# EAGLE design alu (EAGLE 6.5.0)
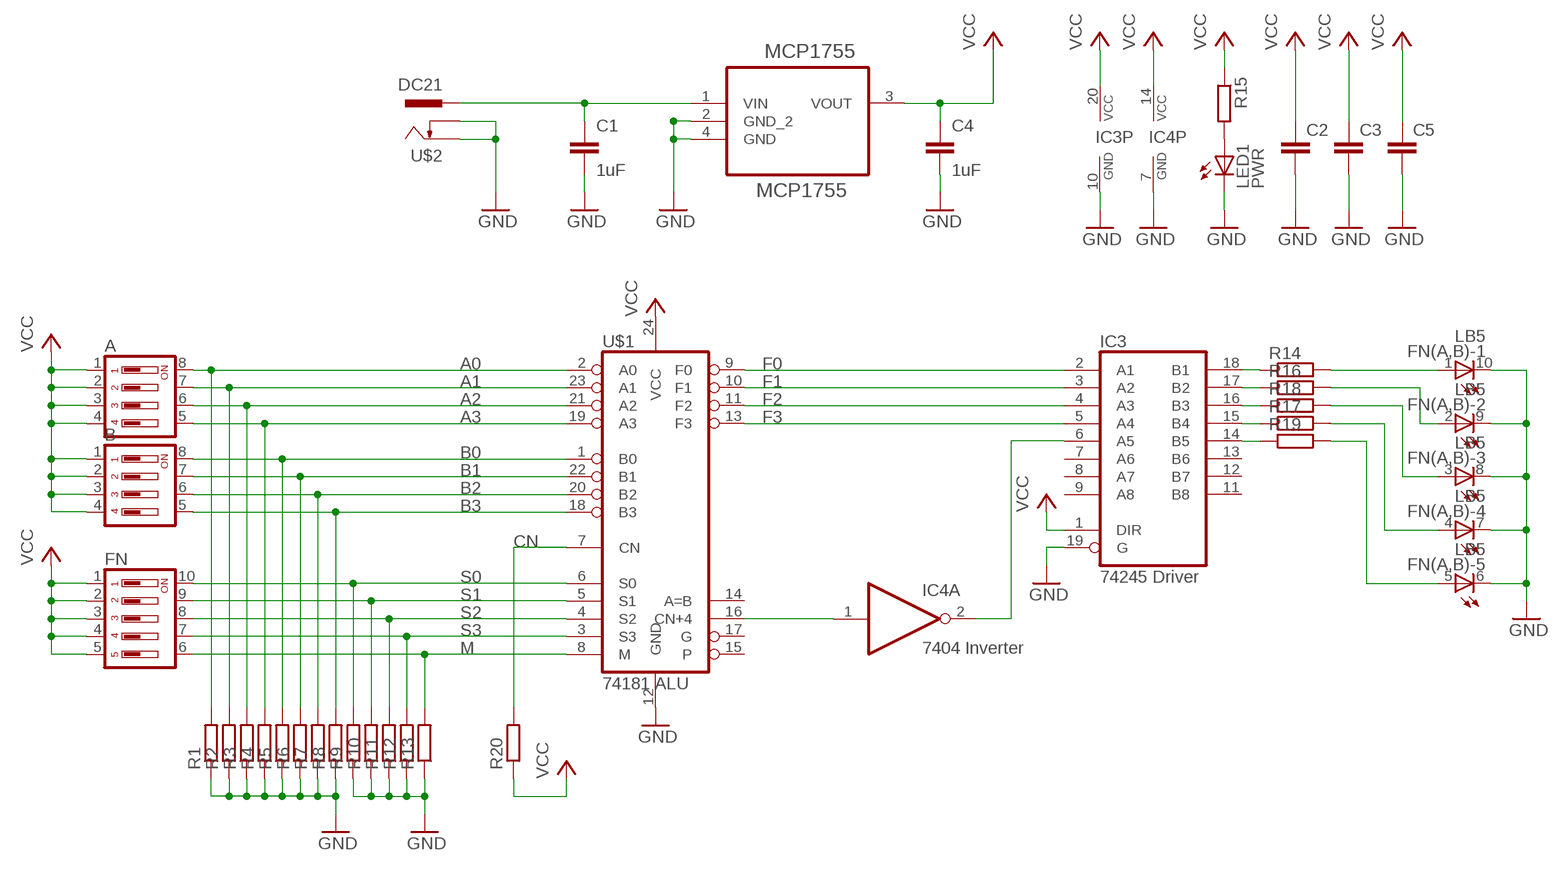
[diagram p0: schematic, sheet 1]

## Parts
A  DS04  [DS-04]
B  DS04  [DS-04]
C1  1uF  C-EUC0805  [C0805]
C2  C-EUC0805  [C0805]
C3  C-EUC0805  [C0805]
C4  1uF  C-EUC0805  [C0805]
C5  C-EUC0805  [C0805]
FN  DS05  [DS-05]
FN(A,B)  LB5  [LB5]
IC3  74245 Driver  74HC245N  [DIL20]
IC4  7404 Inverter  74HC04N  [DIL14]
LED1  PWR  LED3MM  [LED3MM]
MCP1755  MCP1755  MCP1755ST-5002E/DB  [SOT230P700X180-4N]
R1  R-EU_R0805  [R0805]
R2  R-EU_R0805  [R0805]
R3  R-EU_R0805  [R0805]
R4  R-EU_R0805  [R0805]
R5  R-EU_R0805  [R0805]
R6  R-EU_R0805  [R0805]
R7  R-EU_R0805  [R0805]
R8  R-EU_R0805  [R0805]
R9  R-EU_R0805  [R0805]
R10  R-EU_R0805  [R0805]
R11  R-EU_R0805  [R0805]
R12  R-EU_R0805  [R0805]
R13  R-EU_R0805  [R0805]
R14  R-EU_R0805  [R0805]
R15  470  R-EU_R0805  [R0805]
R16  R-EU_R0805  [R0805]
R17  R-EU_R0805  [R0805]
R18  R-EU_R0805  [R0805]
R19  R-EU_R0805  [R0805]
R20  R-EU_R0805  [R0805]
U$1  74181 ALU  MM74HC181N  [DIL24]
U$2  DC21  [DCSKT]

## Nets
!CN+4: IC3.6(A5) IC4.2(A:O)
+VRAW [VCC]: C1.1 MCP1755.1(VIN) U$2.1
A0: A.8 R1.2 U$1.2(A0)
A1: A.7 R2.2 U$1.23(A1)
A2: A.6 R3.2 U$1.21(A2)
A3: A.5 R4.2 U$1.19(A3)
B0: B.8 R5.2 U$1.1(B0)
B1: B.7 R6.2 U$1.22(B1)
B2: B.6 R7.2 U$1.20(B2)
B3: B.5 R8.2 U$1.18(B3)
CN: R20.2 U$1.7(CN)
CN+4: IC4.1(A:I) U$1.16(CN+4)
F0: IC3.2(A1) U$1.9(F0)
F1: U$1.10(F1)
F2: IC3.4(A3) U$1.11(F2)
F3: IC3.5(A4) U$1.13(F3)
GND [GND]: C1.2 C2.2 C3.2 C4.2 C5.2 FN(A,B).6(-5:C) FN(A,B).7(-4:C) FN(A,B).8(-3:C) FN(A,B).9(-2:C) FN(A,B).10(-1:C) IC3.10(GND) IC3.19(G) IC4.7(P:GND) LED1.K(C) MCP1755.2(GND_2) MCP1755.4(GND) R1.1 R2.1 R3.1 R4.1 R5.1 R6.1 R7.1 R8.1 R9.1 R10.1 R11.1 R12.1 R13.1 U$1.12(GND) U$2.2 U$2.3
M: FN.6 R13.2 U$1.8(M)
N$15: IC3.18(B1) R14.1
N$17: LED1.A R15.2
N$20: IC3.17(B2) R16.1
N$21: IC3.16(B3) R18.1
N$22: IC3.15(B4) R17.1
N$23: IC3.14(B5) R19.1
N$24: FN(A,B).1(-1:A) R14.2
N$25: FN(A,B).2(-2:A) R16.2
N$26: FN(A,B).3(-3:A) R18.2
N$28: FN(A,B).4(-4:A) R17.2
N$29: FN(A,B).5(-5:A) R19.2
S0: FN.10 R9.2 U$1.6(S0)
S1: FN.9 R10.2 U$1.5(S1)
S2: FN.8 R11.2 U$1.4(S2)
S3: FN.7 R12.2 U$1.3(S3)
VCC [VCC]: A.1 A.2 A.3 A.4 B.1 B.2 B.3 B.4 C2.1 C3.1 C4.1 C5.1 FN.1 FN.2 FN.3 FN.4 FN.5 IC3.1(DIR) IC3.20(VCC) IC4.14(P:VCC) MCP1755.3(VOUT) R15.1 R20.1 U$1.24(VCC)
Unconnected: IC3.3(A2) IC3.7(A6) IC3.8(A7) IC3.9(A8) IC3.11(B8) IC3.12(B7) IC3.13(B6) IC4.3(B:I) IC4.4(B:O) IC4.5(C:I) IC4.6(C:O) IC4.8(D:O) IC4.9(D:I) IC4.10(E:O) IC4.11(E:I) IC4.12(F:O) IC4.13(F:I) U$1.14(A=B) U$1.15(P) U$1.17(G)

## Library data of the parts
A B = switch-dil:DS04: DIL/CODE SWITCH; OC_FARNELL: 9471570; OC_NEWARK: unknown
C1-C5 = resistor:C-EU: CAPACITOR, European symbol
FN = switch-dil:DS05: DIL/CODE SWITCH; OC_FARNELL: 1255225; OC_NEWARK: unknown
FN(A,B) = thierry_eagle:LB5: LED BLOCK 5-LED bar graph, DIL, Siemens
IC3 = 74xx-eu:74*245: Octal BUS TRANSCEIVER, 3-state
IC4 = 74xx-eu:74*04: Hex INVERTER
LED1 = led:LED: LED OSRAM: - CHIPLED LG R971, LG N971, LY N971, LG Q971, LY Q971, LO R971, LY R971 LH N974, LH R974 LS Q976, LO Q976, LY Q976 LO Q996 - Hyper CHIPLED LW Q18S LB Q993, LB Q99A, LB R99A - SideLED LS A670, LO A670, LY A670, LG A670, LP A670 LB A673, LV A673, LT A673, LW A673 LH A674 LY A675 LS A676, LA A676, LO A676, LY A676, LW A676 LS A679, LY A679, LG A679 - Hyper Micro SIDELED® LS Y876, LA Y876, LO Y876, LY Y876 LT Y87S - SmartLED LW L88C, LW L88S LB L89C, LB L89S, LG L890 LS L89K, LO L89K, LY L89K LS L896, LA L896, LO L896, LY L896 - TOPLED LS T670, LO T670, LY T670, LG T670, LP T670 LSG T670, LSP T670, LSY T670, LOP T670, LYG T670 LG T671, LOG T671, LSG T671 LB T673, LV T673, LT T673, LW T673 LH T674 LS T676, LA T676, LO T676, LY T676, LB T676, LH T676, LSB T676, LW T676 LB T67C, LV T67C, LT T67C, LS T67K, LO T67K, LY T67K, LW E67C LS E67B, LA E67B, LO E67B, LY E67B, LB E67C, LV E67C, LT E67C LW T67C LS T679, LY T679, LG T679 LS T770, LO T770, LY T770, LG T770, LP T770 LB T773, LV T773, LT T773, LW T773 LH T774 LS E675, LA E675, LY E675, LS T675 LS T776, LA T776, LO T776, LY T776, LB T776 LHGB T686 LT T68C, LB T68C - Hyper Mini TOPLED® LB M676 - Mini TOPLED Santana® LG M470 LS M47K, LO M47K, LY M47K Source: http://www.osram.convergy.de LUXEON: - LUMILED® LXK2-PW12-R00, LXK2-PW12-S00, LXK2-PW14-U00, LXK2-PW14-V00 LXK2-PM12-R00, LXK2-PM12-S00, LXK2-PM14-U00 LXK2-PE12-Q00, LXK2-PE12-R00, LXK2-PE12-S00, LXK2-PE14-T00, LXK2-PE14-U00 LXK2-PB12-K00, LXK2-PB12-L00, LXK2-PB12-M00, LXK2-PB14-N00, LXK2-PB14-P00, LXK2-PB14-Q00 LXK2-PR12-L00, LXK2-PR12-M00, LXK2-PR14-Q00, LXK2-PR14-R00 LXK2-PD12-Q00, LXK2-PD12-R00, LXK2-PD12-S00 LXK2-PH12-R00, LXK2-PH12-S00 LXK2-PL12-P00, LXK2-PL12-Q00, LXK2-PL12-R00 Source: www.luxeon.com KINGBRIGHT: KA-3528ASYC Source: www.kingbright.com
MCP1755 = thierry_eagle:MCP1755ST-5002E/DB: LDO, 0.3VDO, 0.3A, 5V, 2%, 3SOT223; MPN: MCP1755ST-5002E/DB; OC_FARNELL: 2306611; OC_NEWARK: 88W3161; PACKAGE: SOT223-3; SUPPLIER: Microchip
R1-R14 R16-R20 = resistor:R-EU_: RESISTOR, European symbol
R15 = rcl:R-EU_: RESISTOR, European symbol
U$1 = thierry_eagle:MM74HC181N: CMOS 181 ALU
U$2 = dcsocket:DC21: DC 2.1 mm Power Socket Negative Centre

## Net classes
0 default: width 0.254 mm, drill 0.508 mm
1 VCC: width 0.66 mm, drill 0.508 mm
2 GND: width 0.66 mm, drill 0.508 mm

## Board
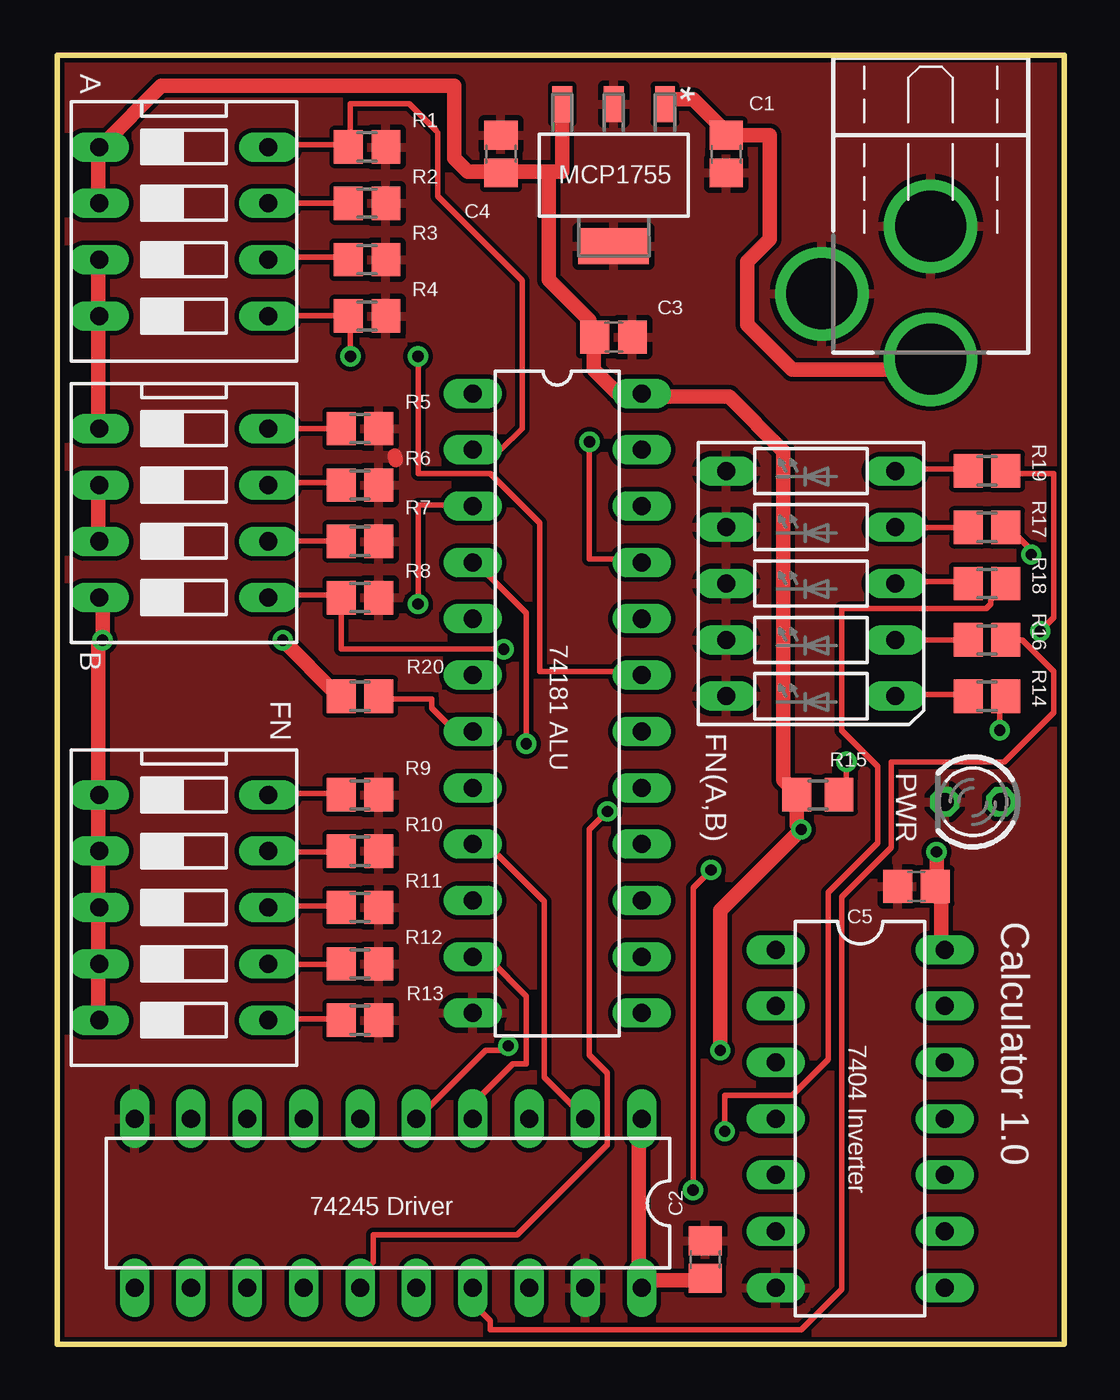
[diagram p1: board, top side]
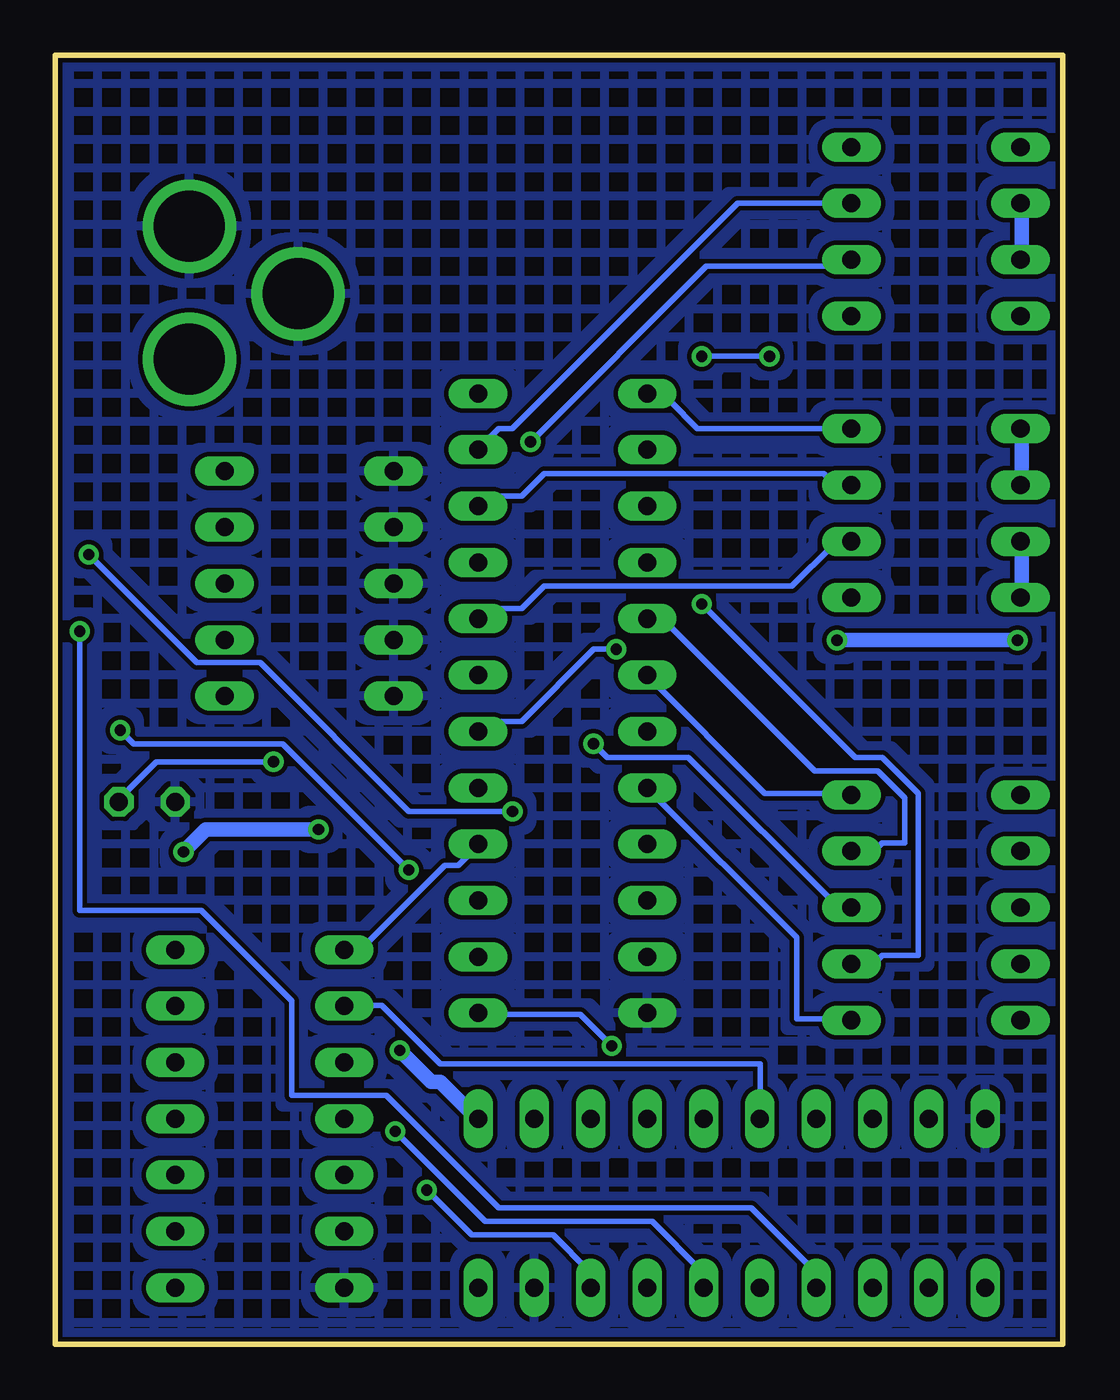
[diagram p2: board, bottom side, seen from below]

Size 45.4 x 58.1 mm. Coordinates in mm from the lower left corner, seen from the top.
Outline: 0,0 0,58.1 45.4,58.1 45.4,0 0,0
Copper layers (1*16): Top 0.035mm / dielectric 1.5mm / Bottom 0.035mm
Design rules "default *": minimum track width 10mil, minimum drill 20mil, track to track 8mil, track to pad 8mil, pad to pad 8mil, via to via 8mil, smd to smd 8mil, copper to edge 8mil, drill to drill 8mil, minimum pad ring 10mil, minimum via ring 8mil, stop-mask expansion 4mil, vias tented up to drill 0mil, thermal gap 10mil

### Footprints (pad centres in the part's own frame; a part is rotated, then mirrored left to right if it is on the bottom)
DS-04 = drill 0.813 long: 1 -3.81,-3.81; 2 -1.27,-3.81; 3 1.27,-3.81; 4 3.81,-3.81; 5 3.81,3.81; 6 1.27,3.81; 7 -1.27,3.81; 8 -3.81,3.81
C0805 = smd 1.3 x 1.5: 1 -0.85,0; 2 0.85,0
DS-05 = drill 0.813 long: 1 -5.08,-3.81; 2 -2.54,-3.81; 3 0,-3.81; 4 2.54,-3.81; 5 5.08,-3.81; 6 5.08,3.81; 7 2.54,3.81; 8 0,3.81; 9 -2.54,3.81; 10 -5.08,3.81
LB5 = drill 0.813 long: 1 -5.08,-3.81; 2 -2.54,-3.81; 3 0,-3.81; 4 2.54,-3.81; 5 5.08,-3.81; 6 5.08,3.81; 7 2.54,3.81; 8 0,3.81; 9 -2.54,3.81; 10 -5.08,3.81
DIL20 = drill 0.813 long: 1 -11.43,-3.81; 2 -8.89,-3.81; 3 -6.35,-3.81; 4 -3.81,-3.81; 5 -1.27,-3.81; 6 1.27,-3.81; 7 3.81,-3.81; 8 6.35,-3.81; 9 8.89,-3.81; 10 11.43,-3.81; 11 11.43,3.81; 12 8.89,3.81; 13 6.35,3.81; 14 3.81,3.81; 15 1.27,3.81; 16 -1.27,3.81; 17 -3.81,3.81; 18 -6.35,3.81; 19 -8.89,3.81; 20 -11.43,3.81
DIL14 = drill 0.813 long: 1 -7.62,-3.81; 2 -5.08,-3.81; 3 -2.54,-3.81; 4 0,-3.81; 5 2.54,-3.81; 6 5.08,-3.81; 7 7.62,-3.81; 8 7.62,3.81; 9 5.08,3.81; 10 2.54,3.81; 11 0,3.81; 12 -2.54,3.81; 13 -5.08,3.81; 14 -7.62,3.81
LED3MM = drill 0.813 octagon: A -1.27,0; K 1.27,0
SOT230P700X180-4N = smd 1.626 x 0.889: 1 -3.2,2.311; 2 -3.2,0; 3 -3.2,-2.311 | smd 1.626 x 3.175: 4 3.2,0
R0805 = smd 1.3 x 1.5: 1 -0.85,0; 2 0.85,0
R0805' = smd 1.3 x 1.5: 1 -0.95,0; 2 0.95,0
DIL24 = drill 0.813 long: 1 -13.97,-3.81; 2 -11.43,-3.81; 3 -8.89,-3.81; 4 -6.35,-3.81; 5 -3.81,-3.81; 6 -1.27,-3.81; 7 1.27,-3.81; 8 3.81,-3.81; 9 6.35,-3.81; 10 8.89,-3.81; 11 11.43,-3.81; 12 13.97,-3.81; 13 13.97,3.81; 14 11.43,3.81; 15 8.89,3.81; 16 6.35,3.81; 17 3.81,3.81; 18 1.27,3.81; 19 -1.27,3.81; 20 -3.81,3.81; 21 -6.35,3.81; 22 -8.89,3.81; 23 -11.43,3.81; 24 -13.97,3.81
DCSKT = drill 3.2: 1 0,6.08; 2 0,0.08; 3 4.9,3.13

### Placement (x,y rotation side)
A  5.71,50.16 270 top
B  5.71,37.46 270 top
C1  30.16,53.66 270 top
C2  29.21,3.81 90 top
C3  25.08,45.4 0 top
C4  20,53.66 90 top
C5  38.73,20.64 180 top
FN  5.71,19.69 270 top
FN(A,B)  33.97,34.29 90 top
IC3  14.92,6.35 180 top
IC4  36.19,10.16 270 top
LED1  41.28,24.45 180 top
MCP1755  25.08,52.71 270 top
R1  13.97,53.98 180 top
R2  13.97,51.43 180 top
R3  13.97,48.9 180 top
R4  13.97,46.35 180 top
R5  13.65,41.27 180 top
R6  13.65,38.73 180 top
R7  13.65,36.2 180 top
R8  13.65,33.65 180 top
R9  13.65,24.77 180 top
R10  13.65,22.23 180 top
R11  13.65,19.69 180 top
R12  13.65,17.14 180 top
R13  13.65,14.6 180 top
R14  41.91,29.21 180 top
R15  470  [R0805']  34.29,24.77 0 top
R16  41.91,31.75 180 top
R17  41.91,36.83 180 top
R18  41.91,34.29 180 top
R19  41.91,39.37 180 top
R20  13.65,29.21 0 top
U$1  22.54,28.89 270 top
U$2  39.37,50.48 180 top

### Tracks (layer width: path | path; a pad name or v marks a point on that pad's centre or on a via)
!CN+4
  Bottom 0.254: IC3.6 13.63,10.2 13.63,12.64 28.05,12.64 30.7,15.28 32.32,15.28 IC4.2
+VRAW
  Top 0.66: MCP1755.1 27.44,55.92 27.44,56.12 28.66,56.12 30.09,54.7 C1.1 30.49,54.5 32.12,54.5 32.12,49.82 31.1,48.81 31.1,45.96 33.13,43.93 39.23,43.93 39.23,44.34 U$2.1
A0
  Top 0.254: A.8 9.56,54.09 13.02,54.09 R1.2 13.22,54.09 13.22,55.92 15.86,55.92 17.08,54.7 17.15,54.61 17.15,51.75 20.96,47.94 20.96,41.27 20,40.32 18.91,40.32 | 18.71,40.47 18.86,40.32 18.91,40.32 | U$1.2 18.91,40.27 18.91,40.32
A1
  Top 0.254: R2.2 13.02,51.45 9.56,51.45 A.7
  Bottom 0.254: U$1.23 26.23,40.47 25.41,41.29 24.8,41.29 14.64,51.45 9.56,51.45 A.7
A2  (via drill 0.51)
  Top 0.254: R3.2 13.02,49.01 9.56,49.01 A.6 | v23.99,40.68 23.99,35.39 26.23,35.39 U$1.21
  Bottom 0.254: v23.99,40.68 16.07,48.6 9.77,48.6 9.56,48.81 A.6
A3  (via drill 0.51)
  Top 0.254: A.5 9.56,46.37 13.02,46.37 R4.2 13.22,46.16 v13.22,44.54 | v16.27,44.54 16.27,39.26 19.52,39.26 21.76,37.02 21.76,30.31 26.23,30.31 U$1.19
  Bottom 0.254: v16.27,44.54 v13.22,44.54
B0
  Top 0.254: R5.2 12.61,41.29 9.56,41.29 B.8
  Bottom 0.254: U$1.1 18.71,42.71 18.5,42.51 17.69,42.51 16.47,41.29 9.56,41.29 B.8
B1
  Top 0.254: R6.2 12.61,38.85 9.56,38.85 B.7
  Bottom 0.254: U$1.22 26.23,37.83 25.82,38.24 24.4,38.24 23.38,39.26 10.78,39.26 10.38,38.85 9.56,38.85 B.7
B2
  Top 0.254: R7.2 12.61,36.21 9.56,36.21 B.6
  Bottom 0.254: U$1.20 26.23,32.75 25.82,33.16 24.4,33.16 23.38,34.18 12.2,34.18 10.38,36 9.56,36 B.6
B3  (via drill 0.51)
  Top 0.254: B.5 9.56,33.77 12.61,33.77 R8.2 12.81,33.57 12.81,31.33 v20.13,31.33
  Bottom 0.254: v20.13,31.33 21.15,31.33 24.4,28.08 25.82,28.08 26.23,27.67 U$1.18
CN
  Top 0.254: R20.2 14.64,29.1 16.88,29.1 16.88,28.69 17.89,27.67 18.71,27.67 U$1.7
CN+4
  Bottom 0.254: U$1.16 26.43,22.39 27.24,21.58 27.85,21.58 31.51,17.92 32.32,17.92 IC4.1
F0
  Top 0.254: IC3.2 23.79,10.2 21.96,12.03 21.96,19.95 19.52,22.39 18.91,22.39 U$1.9
F2
  Top 0.254: IC3.4 18.91,10.2 19.11,10.4 19.11,11.21 20.54,12.64 21.15,12.64 21.15,15.68 19.52,17.31 18.91,17.31 U$1.11
F3  (via drill 0.51)
  Top 0.254: v20.33,13.45 20.33,13.25 19.32,13.25 16.27,10.2 IC3.5
  Bottom 0.254: v20.33,13.45 21.76,14.87 26.23,14.87 U$1.13
GND
  Top 0.66: 15.25,39.87 15.21,40.07 | R8.1 14.64,33.57 14.62,33.53
  pour Bottom (hatched): -0.95,59.05 46.35,59.05 46.35,-0.95 -0.95,-0.95
  pour Top: -0.95,59.05 46.35,59.05 46.35,-0.95 -0.95,-0.95
M
  Top 0.254: R13.2 12.61,14.67 9.56,14.67 FN.6
  Bottom 0.254: U$1.8 18.71,25.03 12,18.33 12,14.67 9.56,14.67 FN.6
N$15  (via drill 0.51)
  Top 0.254: v42.48,27.67 42.48,28.89 42.68,29.1 R14.1 | v29.48,21.37 28.66,20.56 v28.66,6.95
  Bottom 0.254: v42.48,27.67 41.87,27.06 35.17,27.06 v29.48,21.37 | v28.66,6.95 26.63,4.91 22.97,4.91 21.35,3.29 21.35,2.68 IC3.18
N$17  (via drill 0.51)
  Top 0.254: v35.57,26.25 35.57,25.03 35.37,24.83 R15.2
  Bottom 0.254: v35.57,26.25 40.86,26.25 42.48,24.63 LED1.A
N$20
  Top 0.254: R16.1 42.89,31.74 43.5,31.74 44.92,30.31 44.92,28.49 42.68,26.25 37.6,26.25 37.6,22.39 35.37,20.15 35.37,2.48 33.54,0.65 19.52,0.65 19.52,1.05 18.91,1.66 18.91,2.48 IC3.17
N$21  (via drill 0.51)
  Top 0.254: v30.09,9.59 30.09,11.21 33.13,11.21 34.76,12.84 34.76,20.36 37,22.59 37,26.05 35.37,27.67 35.37,33.16 41.87,33.16 42.08,33.36 42.08,33.57 42.68,34.18 R18.1
  Bottom 0.254: v30.09,9.59 26.02,5.52 18.5,5.52 16.27,3.29 16.27,2.68 IC3.16
N$22  (via drill 0.51)
  Top 0.254: v43.9,35.6 43.9,35.8 42.89,36.82 R17.1 | v24.8,24.02 23.99,23.2 23.99,13.04 24.8,12.23 24.8,8.98 20.74,4.91 14.24,4.91 14.24,3.7 13.83,3.29 13.83,2.68 IC3.15
  Bottom 0.254: v43.9,35.6 39.03,30.72 36.18,30.72 29.48,24.02 v24.8,24.02
N$23  (via drill 0.51)
  Top 0.254: v44.31,32.14 44.92,32.75 44.92,39.26 42.89,39.26 R19.1
  Bottom 0.254: v44.31,32.14 44.31,19.55 38.82,19.55 34.76,15.48 34.76,11.21 30.49,11.21 25.41,6.13 14.03,6.13 11.19,3.29 11.19,2.68 IC3.14
N$24
  Top 0.254: R14.2 41.06,29.3 37.81,29.3 FN(A,B).1
N$25
  Top 0.254: R16.2 41.06,31.74 37.81,31.74 FN(A,B).2
N$26
  Top 0.254: R18.2 41.06,34.38 37.81,34.38 FN(A,B).3
N$28
  Top 0.254: R17.2 41.06,36.82 37.81,36.82 FN(A,B).4
N$29
  Top 0.254: R19.2 41.06,39.46 37.81,39.46 FN(A,B).5
S0
  Top 0.254: R9.2 12.61,24.83 9.56,24.83 FN.10
  Bottom 0.254: U$1.6 18.71,30.11 13.42,24.83 9.56,24.83 FN.10
S1
  Top 0.254: R10.2 12.61,22.19 9.56,22.19 FN.9
  Bottom 0.254: U$1.5 18.71,32.55 18.5,32.35 17.69,32.35 11.19,25.84 8.34,25.84 7.12,24.63 7.12,22.59 8.14,22.59 8.55,22.19 9.36,22.19 FN.9
S2  (via drill 0.51)
  Top 0.254: R11.2 12.61,19.75 9.56,19.75 FN.8 | v21.15,27.06 21.15,32.96 18.91,35.19 U$1.4
  Bottom 0.254: v21.15,27.06 20.54,26.45 16.88,26.45 10.17,19.75 9.56,19.75 FN.8
S3  (via drill 0.51)
  Top 0.254: R12.2 12.61,17.11 9.56,17.11 FN.7 | v16.27,33.36 16.27,37.83 18.71,37.83 U$1.3
  Bottom 0.254: v16.27,33.36 9.36,26.45 8.14,26.45 6.52,24.83 6.52,17.51 8.14,17.51 8.55,17.11 9.36,17.11 FN.7
VCC  (via drill 0.51)
  Top 0.66: FN.5 1.84,14.67 1.84,17.11 FN.4 1.84,17.31 1.84,19.55 FN.3 1.84,19.75 1.84,22.19 FN.2 1.84,22.39 1.84,24.63 FN.1 1.84,25.03 1.84,31.53 v2.04,31.74 2.04,33.57 B.4 | A.3 1.84,48.81 1.84,46.37 A.4 1.84,46.16 1.84,41.29 B.1 | A.2 1.84,51.45 1.84,53.89 A.1 2.04,54.09 4.69,56.73 17.89,56.73 17.89,53.48 18.5,52.87 19.72,52.87 C4.1 20.13,52.87 22.16,52.87 | v10.17,31.74 12.61,29.3 R20.1 | B.2 1.84,38.65 1.84,36.21 B.3 | C2.1 29.07,2.88 26.43,2.88 26.43,2.68 IC3.20 26.23,3.09 26.23,9.99 IC3.1 | 22.16,52.87 22.77,52.87 MCP1755.3 | 40.04,17.72 IC4.14 39.84,17.92 39.84,20.36 39.64,20.56 C5.1 39.64,20.76 v39.64,22.19 | U$1.24 26.23,42.91 25.21,42.91 24.19,43.93 24.19,45.35 C3.1 23.99,45.55 23.99,46.16 22.16,47.99 22.16,52.87 | U$1.24 26.63,42.71 30.29,42.71 32.73,40.27 32.73,25.44 33.34,24.83 R15.1 33.34,24.63 33.34,23.41 v33.54,23.2 29.88,19.55 v29.88,13.25 | 26.43,42.91 U$1.24
  Bottom 0.66: A.2 1.84,51.24 1.84,49.01 A.3 | v2.04,31.74 v10.17,31.74 | B.3 1.84,36 1.84,33.77 B.4 | B.1 1.84,41.08 1.84,38.85 B.2 | v39.64,22.19 38.62,23.2 v33.54,23.2 | v29.88,13.25 28.46,11.82 28.05,11.82 26.43,10.2 IC3.1

### Text on the board
tNames: Calculator 1.0